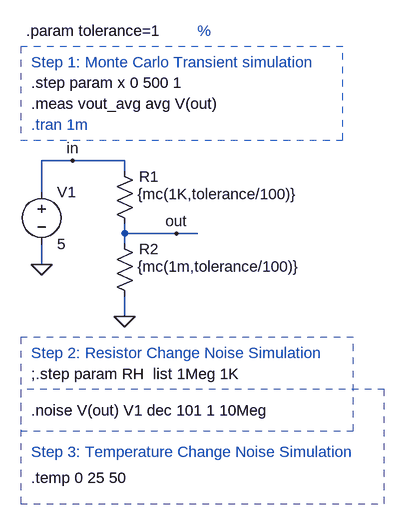
[diagram p0: schematic 17-monte_carlo_voltage_divider.asc]
17-monte_carlo_voltage_divider.asc, the LTspice schematic file:
Version 4
SHEET 1 880 680
WIRE 64 16 16 16
WIRE 144 16 64 16
WIRE 144 32 144 16
WIRE 16 64 16 16
WIRE 144 128 144 112
WIRE 224 128 144 128
WIRE 256 128 224 128
WIRE 144 144 144 128
WIRE 16 176 16 144
WIRE 144 256 144 224
FLAG 144 256 0
FLAG 16 176 0
FLAG 224 128 out
FLAG 64 16 in
SYMBOL res 128 16 R0
WINDOW 0 38 24 Left 2
WINDOW 3 36 51 Left 2
SYMATTR InstName R1
SYMATTR Value {mc(1K,tolerance/100)}
SYMBOL voltage 16 48 R0
WINDOW 123 0 0 Left 0
WINDOW 39 0 0 Left 0
SYMATTR InstName V1
SYMATTR Value 5
SYMBOL res 128 128 R0
WINDOW 0 38 24 Left 2
WINDOW 3 36 51 Left 2
SYMATTR InstName R2
SYMATTR Value {mc(1m,tolerance/100)}
TEXT -8 -184 Left 2 !.param tolerance=1
TEXT 256 -184 Left 2 ;%
TEXT 0 -40 Left 2 ;.tran 1m
TEXT 0 -104 Left 2 !.step param x 0 500 1
TEXT 0 -72 Left 2 !.meas vout_avg avg V(out)
TEXT 0 400 Left 2 !.noise V(out) V1 dec 101 1 10Meg
TEXT 0 344 Left 2 !;.step param RH  list 1Meg 1K
TEXT 0 504 Left 2 !.temp 0 25 50
TEXT 0 -136 Left 2 ;Step 1: Monte Carlo Transient simulation
TEXT 0 312 Left 2 ;Step 2: Resistor Change Noise Simulation
TEXT 0 464 Left 2 ;Step 3: Temperature Change Noise Simulation
RECTANGLE Normal -16 -16 480 -160 1
RECTANGLE Normal -16 432 496 288 1
RECTANGLE Normal -16 544 544 368 3

The netlist it stands for:
* 17-monte_carlo_voltage_divider.asc
R1 in out {mc(1K,tolerance/100)}
V1 in 0 5
R2 out 0 {mc(1m,tolerance/100)}
.param tolerance=1
* %
* .tran 1m
.step param x 0 500 1
.meas vout_avg avg V(out)
.noise V(out) V1 dec 101 1 10Meg
;.step param RH  list 1Meg 1K
.temp 0 25 50
* Step 1: Monte Carlo Transient simulation
* Step 2: Resistor Change Noise Simulation
* Step 3: Temperature Change Noise Simulation
.backanno
.end